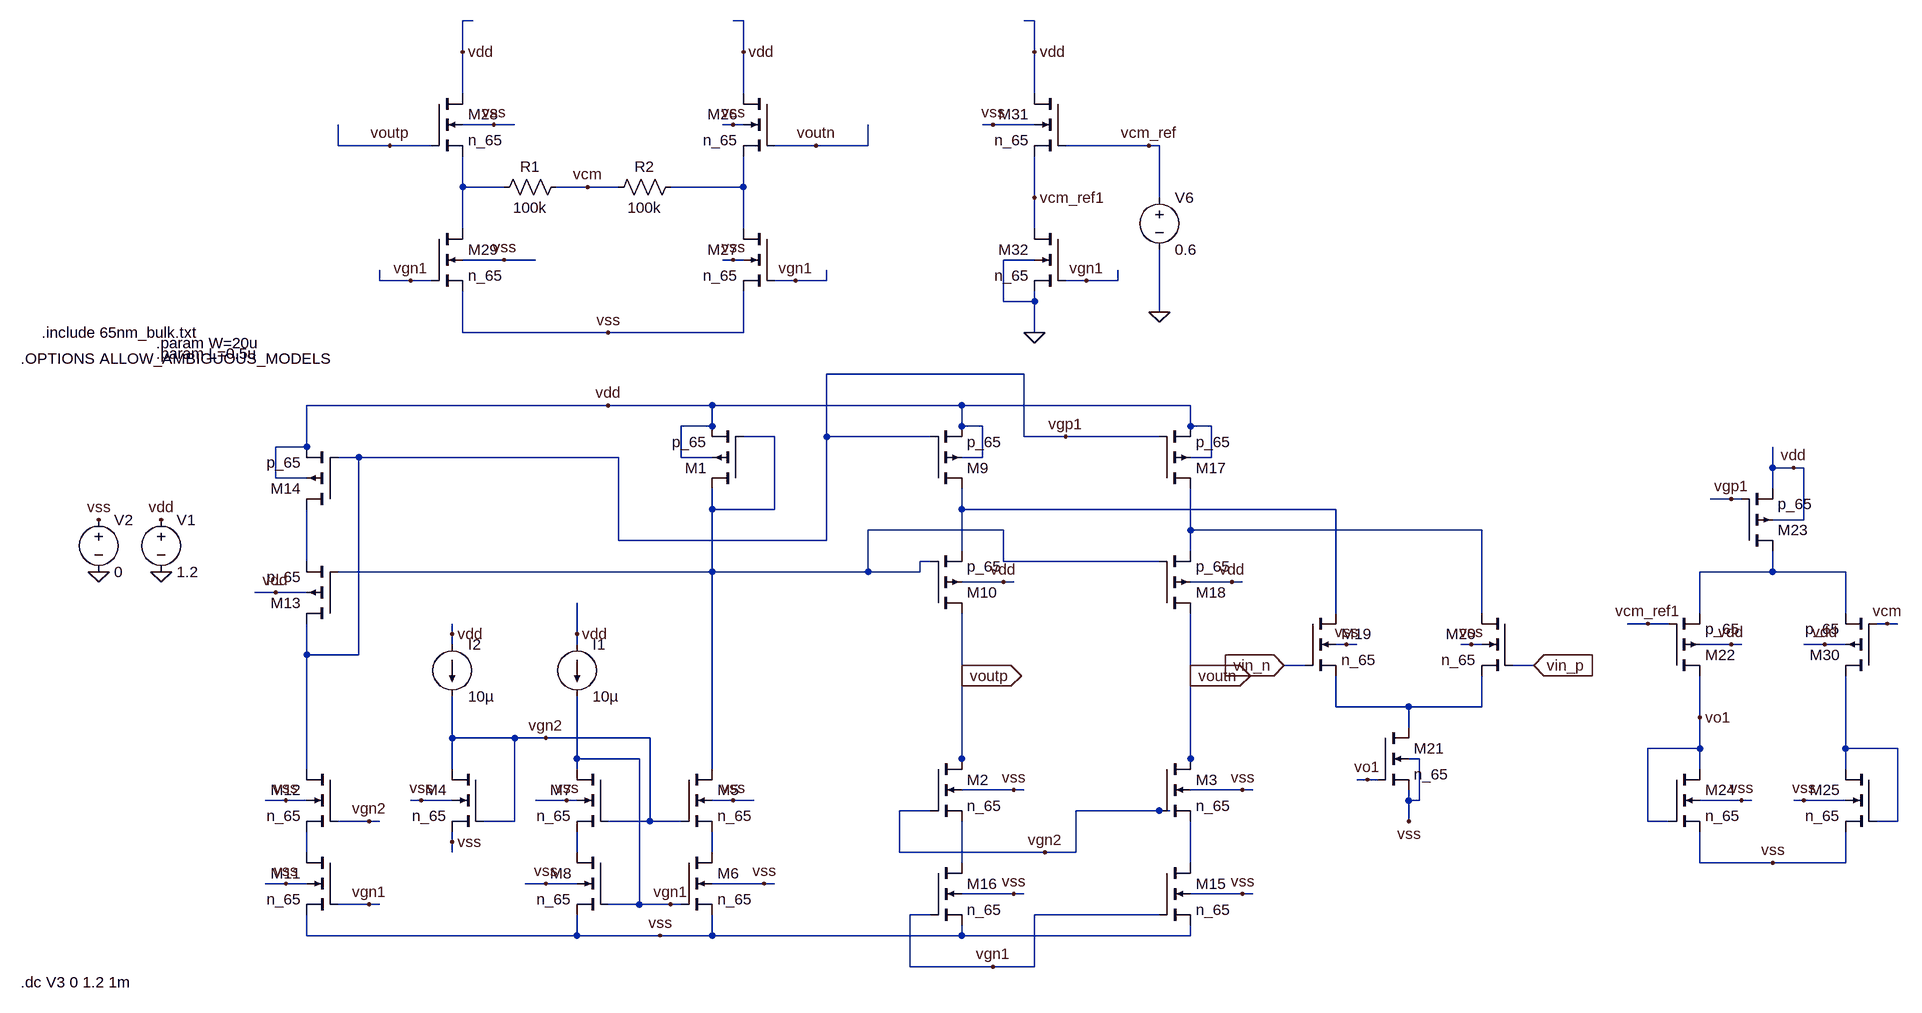
[diagram p0: schematic FC_OTA_small_input.asc]
FC_OTA_small_input.asc, the LTspice schematic file:
Version 4.1
SHEET 1 1988 876
WIRE -752 -816 -768 -816
WIRE -336 -816 -352 -816
WIRE 112 -816 96 -816
WIRE -768 -768 -768 -816
WIRE -336 -768 -336 -816
WIRE 112 -768 112 -816
WIRE -768 -704 -768 -768
WIRE -336 -704 -336 -768
WIRE 112 -704 112 -768
WIRE -720 -656 -768 -656
WIRE -688 -656 -720 -656
WIRE -352 -656 -368 -656
WIRE -336 -656 -352 -656
WIRE 48 -656 32 -656
WIRE 112 -656 48 -656
WIRE -960 -624 -960 -656
WIRE -880 -624 -960 -624
WIRE -816 -624 -880 -624
WIRE -224 -624 -288 -624
WIRE -144 -624 -144 -656
WIRE -144 -624 -224 -624
WIRE 288 -624 160 -624
WIRE 304 -624 288 -624
WIRE -768 -560 -768 -608
WIRE -704 -560 -768 -560
WIRE -576 -560 -624 -560
WIRE -528 -560 -576 -560
WIRE -336 -560 -336 -608
WIRE -336 -560 -448 -560
WIRE 112 -544 112 -608
WIRE 304 -544 304 -624
WIRE -768 -496 -768 -560
WIRE -336 -496 -336 -560
WIRE 112 -496 112 -544
WIRE -704 -448 -768 -448
WIRE -656 -448 -704 -448
WIRE -352 -448 -368 -448
WIRE -336 -448 -352 -448
WIRE 112 -448 64 -448
WIRE -896 -416 -896 -432
WIRE -848 -416 -896 -416
WIRE -816 -416 -848 -416
WIRE -256 -416 -288 -416
WIRE -208 -416 -208 -432
WIRE -208 -416 -256 -416
WIRE 192 -416 160 -416
WIRE 240 -416 240 -432
WIRE 240 -416 192 -416
WIRE 64 -384 64 -448
WIRE 112 -384 112 -400
WIRE 112 -384 64 -384
WIRE 304 -368 304 -464
WIRE -768 -336 -768 -400
WIRE -544 -336 -768 -336
WIRE -336 -336 -336 -400
WIRE -336 -336 -544 -336
WIRE 112 -336 112 -384
WIRE 96 -272 -208 -272
WIRE -544 -224 -1008 -224
WIRE -384 -224 -544 -224
WIRE 0 -224 -384 -224
WIRE 352 -224 0 -224
WIRE -384 -192 -384 -224
WIRE -384 -192 -432 -192
WIRE 0 -192 0 -224
WIRE 32 -192 0 -192
WIRE 352 -192 352 -224
WIRE 384 -192 352 -192
WIRE -288 -176 -336 -176
WIRE -208 -176 -208 -272
WIRE -48 -176 -208 -176
WIRE 96 -176 96 -272
WIRE 160 -176 96 -176
WIRE 304 -176 160 -176
WIRE -1008 -160 -1008 -224
WIRE -1008 -160 -1056 -160
WIRE -1008 -144 -1008 -160
WIRE -928 -144 -960 -144
WIRE -528 -144 -928 -144
WIRE -432 -144 -432 -192
WIRE -384 -144 -432 -144
WIRE 32 -144 32 -192
WIRE 32 -144 0 -144
WIRE 384 -144 384 -192
WIRE 384 -144 352 -144
WIRE 1248 -128 1248 -160
WIRE 1280 -128 1248 -128
WIRE 1296 -128 1280 -128
WIRE -1056 -112 -1056 -160
WIRE -1008 -112 -1056 -112
WIRE 1248 -96 1248 -128
WIRE 1184 -80 1152 -80
WIRE 1200 -80 1184 -80
WIRE -384 -64 -384 -96
WIRE -288 -64 -288 -176
WIRE -288 -64 -384 -64
WIRE 0 -64 0 -96
WIRE 576 -64 0 -64
WIRE 1296 -48 1296 -128
WIRE 1296 -48 1248 -48
WIRE 64 -32 -144 -32
WIRE 352 -32 352 -96
WIRE 800 -32 352 -32
WIRE -528 -16 -528 -144
WIRE -208 -16 -208 -176
WIRE -208 -16 -528 -16
WIRE 0 0 0 -64
WIRE 352 0 352 -32
WIRE -1008 16 -1008 -64
WIRE -48 16 -64 16
WIRE 64 16 64 -32
WIRE 304 16 64 16
WIRE -384 32 -384 -64
WIRE -384 32 -960 32
WIRE -144 32 -144 -32
WIRE -144 32 -384 32
WIRE -64 32 -64 16
WIRE -64 32 -144 32
WIRE 1248 32 1248 0
WIRE 1248 32 1136 32
WIRE 1360 32 1248 32
WIRE 64 48 0 48
WIRE 80 48 64 48
WIRE 416 48 352 48
WIRE 432 48 416 48
WIRE -1056 64 -1088 64
WIRE -1008 64 -1056 64
WIRE 576 96 576 -64
WIRE 800 96 800 -32
WIRE 1136 96 1136 32
WIRE 1360 96 1360 32
WIRE 1056 112 1024 112
WIRE 1088 112 1056 112
WIRE 1424 112 1408 112
WIRE 1440 112 1424 112
WIRE -784 128 -784 112
WIRE -592 128 -592 80
WIRE -784 144 -784 128
WIRE -592 144 -592 128
WIRE 592 144 576 144
WIRE 608 144 592 144
WIRE 784 144 768 144
WIRE 800 144 784 144
WIRE 1184 144 1136 144
WIRE 1200 144 1184 144
WIRE 1328 144 1296 144
WIRE 1360 144 1328 144
WIRE -1008 160 -1008 112
WIRE -928 160 -928 -144
WIRE -928 160 -1008 160
WIRE 528 176 496 176
WIRE 880 176 848 176
WIRE 0 192 0 96
WIRE 352 192 352 96
WIRE 576 240 576 192
WIRE 688 240 576 240
WIRE 800 240 800 192
WIRE 800 240 688 240
WIRE 1136 256 1136 192
WIRE 688 272 688 240
WIRE -784 288 -784 224
WIRE -688 288 -784 288
WIRE -640 288 -688 288
WIRE -480 288 -640 288
WIRE 1136 304 1136 256
WIRE 1136 304 1056 304
WIRE 1360 304 1360 192
WIRE 1440 304 1360 304
WIRE -592 320 -592 224
WIRE -496 320 -592 320
WIRE 0 320 0 192
WIRE 352 320 352 192
WIRE 704 320 688 320
WIRE -1008 336 -1008 160
WIRE -784 336 -784 288
WIRE -592 336 -592 320
WIRE -384 336 -384 32
WIRE 0 336 0 320
WIRE 352 336 352 320
WIRE 1136 336 1136 304
WIRE 1360 336 1360 304
WIRE 624 352 608 352
WIRE 640 352 624 352
WIRE 80 368 0 368
WIRE 96 368 80 368
WIRE 432 368 352 368
WIRE 448 368 432 368
WIRE -1040 384 -1072 384
WIRE -1008 384 -1040 384
WIRE -832 384 -848 384
WIRE -784 384 -832 384
WIRE -608 384 -656 384
WIRE -592 384 -608 384
WIRE -352 384 -384 384
WIRE -320 384 -352 384
WIRE 688 384 688 368
WIRE 704 384 704 320
WIRE 704 384 688 384
WIRE 1200 384 1136 384
WIRE 1216 384 1200 384
WIRE 1296 384 1280 384
WIRE 1360 384 1296 384
WIRE -48 400 -96 400
WIRE 304 400 176 400
WIRE 320 400 304 400
WIRE -912 416 -960 416
WIRE -896 416 -912 416
WIRE -688 416 -688 288
WIRE -688 416 -736 416
WIRE -480 416 -480 288
WIRE -480 416 -544 416
WIRE -432 416 -480 416
WIRE 688 416 688 384
WIRE 1056 416 1056 304
WIRE 1088 416 1056 416
WIRE 1440 416 1440 304
WIRE 1440 416 1408 416
WIRE -784 448 -784 432
WIRE -1008 464 -1008 432
WIRE -784 464 -784 448
WIRE -592 464 -592 432
WIRE -384 464 -384 432
WIRE -96 464 -96 400
WIRE 128 464 -96 464
WIRE 176 464 176 400
WIRE 176 464 128 464
WIRE 0 480 0 416
WIRE 352 480 352 416
WIRE 1136 480 1136 432
WIRE 1248 480 1136 480
WIRE 1360 480 1360 432
WIRE 1360 480 1248 480
WIRE -1040 512 -1072 512
WIRE -1008 512 -1040 512
WIRE -640 512 -672 512
WIRE -592 512 -640 512
WIRE -304 512 -384 512
WIRE -288 512 -304 512
WIRE 80 528 0 528
WIRE 96 528 80 528
WIRE 432 528 352 528
WIRE 448 528 432 528
WIRE -912 544 -960 544
WIRE -896 544 -912 544
WIRE -496 544 -496 320
WIRE -496 544 -544 544
WIRE -448 544 -496 544
WIRE -432 544 -448 544
WIRE -48 560 -80 560
WIRE 304 560 112 560
WIRE -1008 592 -1008 560
WIRE -592 592 -592 560
WIRE -592 592 -1008 592
WIRE -464 592 -592 592
WIRE -384 592 -384 560
WIRE -384 592 -464 592
WIRE 0 592 0 576
WIRE 0 592 -384 592
WIRE 352 592 352 576
WIRE 352 592 0 592
WIRE -80 640 -80 560
WIRE 48 640 -80 640
WIRE 112 640 112 560
WIRE 112 640 48 640
FLAG -592 128 vdd
FLAG 80 368 vss
FLAG 80 528 vss
FLAG -352 384 vss
FLAG -464 592 vss
FLAG -784 128 vdd
FLAG -784 448 vss
FLAG -608 384 vss
FLAG 64 48 vdd
FLAG -1040 384 vss
FLAG -912 544 vgn1
FLAG -912 416 vgn2
FLAG -544 -224 vdd
FLAG -1232 32 0
FLAG -1232 -48 vdd
FLAG -1328 32 0
FLAG -1328 -48 vss
FLAG 0 192 voutp
IOPIN 0 192 Out
FLAG 432 368 vss
FLAG 432 528 vss
FLAG 416 48 vdd
FLAG 352 192 voutn
IOPIN 352 192 Out
FLAG 592 144 vss
FLAG 784 144 vss
FLAG 688 416 vss
FLAG 1248 480 vss
FLAG 1200 384 vss
FLAG 1296 384 vss
FLAG 1280 -128 vdd
FLAG 1184 144 vdd
FLAG 880 176 vin_p
IOPIN 880 176 In
FLAG 496 176 vin_n
IOPIN 496 176 In
FLAG 160 -176 vgp1
FLAG -640 288 vgn2
FLAG 48 640 vgn1
FLAG 128 464 vgn2
FLAG -336 -768 vdd
FLAG -256 -416 vgn1
FLAG -224 -624 voutn
FLAG -768 -768 vdd
FLAG -848 -416 vgn1
FLAG -880 -624 voutp
FLAG -544 -336 vss
FLAG -576 -560 vcm
FLAG 1328 144 vdd
FLAG 1424 112 vcm
FLAG 1184 -80 vgp1
FLAG -448 544 vgn1
FLAG 112 -768 vdd
FLAG 192 -416 vgn1
FLAG 304 -368 0
FLAG 288 -624 vcm_ref
FLAG 112 -544 vcm_ref1
FLAG 1056 112 vcm_ref1
FLAG 112 -336 0
FLAG 1136 256 vo1
FLAG 624 352 vo1
FLAG -1056 64 vdd
FLAG -304 512 vss
FLAG -640 512 vss
FLAG -832 384 vss
FLAG -1040 512 vss
FLAG -704 -448 vss
FLAG -352 -448 vss
FLAG -720 -656 vss
FLAG -352 -656 vss
FLAG 48 -656 vss
DATAFLAG -512 288 ""
DATAFLAG -144 32 ""
DATAFLAG 112 -192 ""
DATAFLAG 352 -208 ""
DATAFLAG 1184 32 ""
DATAFLAG 1136 240 ""
DATAFLAG 1360 256 ""
DATAFLAG 0 144 ""
DATAFLAG 352 144 ""
DATAFLAG 688 -32 ""
DATAFLAG 80 -64 ""
DATAFLAG 352 464 ""
DATAFLAG 0 464 ""
DATAFLAG 688 400 ""
DATAFLAG -32 560 ""
DATAFLAG 208 16 ""
DATAFLAG 192 544 ""
DATAFLAG -768 -592 ""
DATAFLAG -336 -576 ""
DATAFLAG -944 -624 ""
DATAFLAG -144 -640 ""
DATAFLAG -944 416 ""
DATAFLAG -944 544 ""
DATAFLAG -528 416 ""
DATAFLAG -528 544 ""
DATAFLAG -640 -144 ""
DATAFLAG -688 32 ""
DATAFLAG -1008 -48 ""
DATAFLAG 224 -640 ""
DATAFLAG 576 -16 ""
DATAFLAG 688 256 ""
DATAFLAG 352 144 ""
SYMBOL pmos4 -336 -96 R180
SYMATTR InstName M1
SYMATTR Value p_65
SYMATTR Value2 l={L} w=0.25*{W}
SYMBOL nmos4 -48 320 R0
SYMATTR InstName M2
SYMATTR Value n_65
SYMATTR Value2 l={L} w={W}
SYMBOL current -592 144 R0
WINDOW 123 0 0 Left 0
WINDOW 39 0 0 Left 0
SYMATTR InstName I1
SYMATTR Value 10µ
SYMBOL current -784 144 R0
WINDOW 123 0 0 Left 0
WINDOW 39 0 0 Left 0
SYMATTR InstName I2
SYMATTR Value 10µ
SYMBOL pmos4 -48 -96 M180
SYMATTR InstName M9
SYMATTR Value p_65
SYMATTR Value2 l={L} w=2*{W}
SYMBOL pmos4 -48 96 M180
SYMATTR InstName M10
SYMATTR Value p_65
SYMATTR Value2 l={L} w={W}
SYMBOL voltage -1232 -64 R0
WINDOW 123 0 0 Left 0
WINDOW 39 0 0 Left 0
SYMATTR InstName V1
SYMATTR Value 1.2
SYMBOL voltage -1328 -64 R0
WINDOW 123 0 0 Left 0
WINDOW 39 0 0 Left 0
SYMATTR InstName V2
SYMATTR Value 0
SYMBOL pmos4 304 -96 M180
SYMATTR InstName M17
SYMATTR Value p_65
SYMATTR Value2 l={L} w=2*{W}
SYMBOL nmos4 528 96 R0
SYMATTR InstName M19
SYMATTR Value n_65
SYMATTR Value2 l=0.5u w=60u
SYMBOL nmos4 848 96 M0
SYMATTR InstName M20
SYMATTR Value n_65
SYMATTR Value2 l=0.5u w=60u
SYMBOL nmos4 640 272 R0
SYMATTR InstName M21
SYMATTR Value n_65
SYMATTR Value2 l={L} w=2*{W}
SYMBOL pmos4 1088 192 M180
SYMATTR InstName M22
SYMATTR Value p_65
SYMATTR Value2 l=65n w=90u
SYMBOL nmos4 -288 -704 M0
SYMATTR InstName M26
SYMATTR Value n_65
SYMATTR Value2 l=65n w=20u
SYMBOL nmos4 -288 -496 M0
SYMATTR InstName M27
SYMATTR Value n_65
SYMATTR Value2 l=200n w=20u
SYMBOL nmos4 -816 -704 R0
SYMATTR InstName M28
SYMATTR Value n_65
SYMATTR Value2 l=65n w=20u
SYMBOL nmos4 -816 -496 R0
SYMATTR InstName M29
SYMATTR Value n_65
SYMATTR Value2 l=200n w=20u
SYMBOL res -608 -576 R90
WINDOW 0 0 56 VBottom 2
WINDOW 3 32 56 VTop 2
SYMATTR InstName R1
SYMATTR Value 100k
SYMATTR SpiceLine tol=1 pwr=0.1
SYMBOL res -432 -576 R90
WINDOW 0 0 56 VBottom 2
WINDOW 3 32 56 VTop 2
SYMATTR InstName R2
SYMATTR Value 100k
SYMATTR SpiceLine tol=1 pwr=0.1
SYMBOL pmos4 1408 192 R180
SYMATTR InstName M30
SYMATTR Value p_65
SYMATTR Value2 l=65n w=90u
SYMBOL nmos4 160 -704 M0
SYMATTR InstName M31
SYMATTR Value n_65
SYMATTR Value2 l=65n w=20u
SYMBOL nmos4 160 -496 M0
SYMATTR InstName M32
SYMATTR Value n_65
SYMATTR Value2 l=200n w=20u
SYMBOL voltage 304 -560 R0
WINDOW 123 0 0 Left 0
WINDOW 39 0 0 Left 0
SYMATTR InstName V6
SYMATTR Value 0.6
SYMBOL pmos4 304 96 M180
SYMATTR InstName M18
SYMATTR Value p_65
SYMATTR Value2 l={L} w={W}
SYMBOL nmos4 304 320 R0
SYMATTR InstName M3
SYMATTR Value n_65
SYMATTR Value2 l={L} w={W}
SYMBOL nmos4 304 480 R0
SYMATTR InstName M15
SYMATTR Value n_65
SYMATTR Value2 l={L} w={W}
SYMBOL nmos4 -48 480 R0
SYMATTR InstName M16
SYMATTR Value n_65
SYMATTR Value2 l={L} w={W}
SYMBOL nmos4 -432 336 R0
SYMATTR InstName M5
SYMATTR Value n_65
SYMATTR Value2 l={L} w={W}
SYMBOL nmos4 -432 464 R0
SYMATTR InstName M6
SYMATTR Value n_65
SYMATTR Value2 l={L} w={W}
SYMBOL nmos4 -736 336 M0
SYMATTR InstName M4
SYMATTR Value n_65
SYMATTR Value2 l={L} w=0.25*{W}
SYMBOL nmos4 -544 336 M0
SYMATTR InstName M7
SYMATTR Value n_65
SYMATTR Value2 l={L} w={W}
SYMBOL nmos4 -544 464 M0
SYMATTR InstName M8
SYMATTR Value n_65
SYMATTR Value2 l={L} w={W}
SYMBOL nmos4 -960 464 M0
SYMATTR InstName M11
SYMATTR Value n_65
SYMATTR Value2 l={L} w={W}
SYMBOL nmos4 -960 336 M0
SYMATTR InstName M12
SYMATTR Value n_65
SYMATTR Value2 l={L} w={W}
SYMBOL pmos4 -960 112 R180
SYMATTR InstName M13
SYMATTR Value p_65
SYMATTR Value2 l={L} w={W}
SYMBOL pmos4 -960 -64 R180
SYMATTR InstName M14
SYMATTR Value p_65
SYMATTR Value2 l={L} w={W}
SYMBOL pmos4 1200 0 M180
SYMATTR InstName M23
SYMATTR Value p_65
SYMATTR Value2 l={L} w=2*{W}
SYMBOL nmos4 1088 336 R0
SYMATTR InstName M24
SYMATTR Value n_65
SYMATTR Value2 l={L} w={W}
SYMBOL nmos4 1408 336 M0
SYMATTR InstName M25
SYMATTR Value n_65
SYMATTR Value2 l={L} w={W}
TEXT -1416 -336 Left 2 !.include 65nm_bulk.txt
TEXT -1448 -296 Left 2 !.OPTIONS ALLOW_AMBIGUOUS_MODELS
TEXT -1240 -320 Left 2 !.param W=20u
TEXT -1240 -304 Left 2 !.param L=0.5u
TEXT -1448 664 Left 2 !.dc V3 0 1.2 1m

The netlist it stands for:
* FC_OTA_small_input.asc
M1 N003 N003 vdd vdd p_65 l={L} w=0.25*{W}
M2 voutp vgn2 N013 vss n_65 l={L} w={W}
I1 vdd vgn1 10µ
I2 vdd vgn2 10µ
M9 N004 vgp1 vdd vdd p_65 l={L} w=2*{W}
M10 voutp N003 N004 vdd p_65 l={L} w={W}
V1 vdd 0 1.2
V2 vss 0 0
M17 N005 vgp1 vdd vdd p_65 l={L} w=2*{W}
M19 N004 vin_n N008 vss n_65 l=0.5u w=60u
M20 N005 vin_p N008 vss n_65 l=0.5u w=60u
M21 N008 vo1 vss vss n_65 l={L} w=2*{W}
M22 vo1 vcm_ref1 N007 vdd p_65 l=65n w=90u
M26 vdd voutn N002 vss n_65 l=65n w=20u
M27 N002 vgn1 vss vss n_65 l=200n w=20u
M28 vdd voutp N001 vss n_65 l=65n w=20u
M29 N001 vgn1 vss vss n_65 l=200n w=20u
R1 vcm N001 100k tol=1 pwr=0.1
R2 N002 vcm 100k tol=1 pwr=0.1
M30 N009 vcm N007 vdd p_65 l=65n w=90u
M31 vdd vcm_ref vcm_ref1 vss n_65 l=65n w=20u
M32 vcm_ref1 vgn1 0 0 n_65 l=200n w=20u
V6 vcm_ref 0 0.6
M18 voutn N003 N005 vdd p_65 l={L} w={W}
M3 voutn vgn2 N014 vss n_65 l={L} w={W}
M15 N014 vgn1 vss vss n_65 l={L} w={W}
M16 N013 vgn1 vss vss n_65 l={L} w={W}
M5 N003 vgn2 N012 vss n_65 l={L} w={W}
M6 N012 vgn1 vss vss n_65 l={L} w={W}
M4 vgn2 vgn2 vss vss n_65 l={L} w=0.25*{W}
M7 vgn1 vgn2 N011 vss n_65 l={L} w={W}
M8 N011 vgn1 vss vss n_65 l={L} w={W}
M11 N010 vgn1 vss vss n_65 l={L} w={W}
M12 vgp1 vgn2 N010 vss n_65 l={L} w={W}
M13 vgp1 N003 N006 vdd p_65 l={L} w={W}
M14 N006 vgp1 vdd vdd p_65 l={L} w={W}
M23 N007 vgp1 vdd vdd p_65 l={L} w=2*{W}
M24 vo1 vo1 vss vss n_65 l={L} w={W}
M25 N009 N009 vss vss n_65 l={L} w={W}
.model NMOS NMOS
.model PMOS PMOS
.lib standard.mos
.include 65nm_bulk.txt
.OPTIONS ALLOW_AMBIGUOUS_MODELS
.param W=20u
.param L=0.5u
.dc V3 0 1.2 1m
.backanno
.end